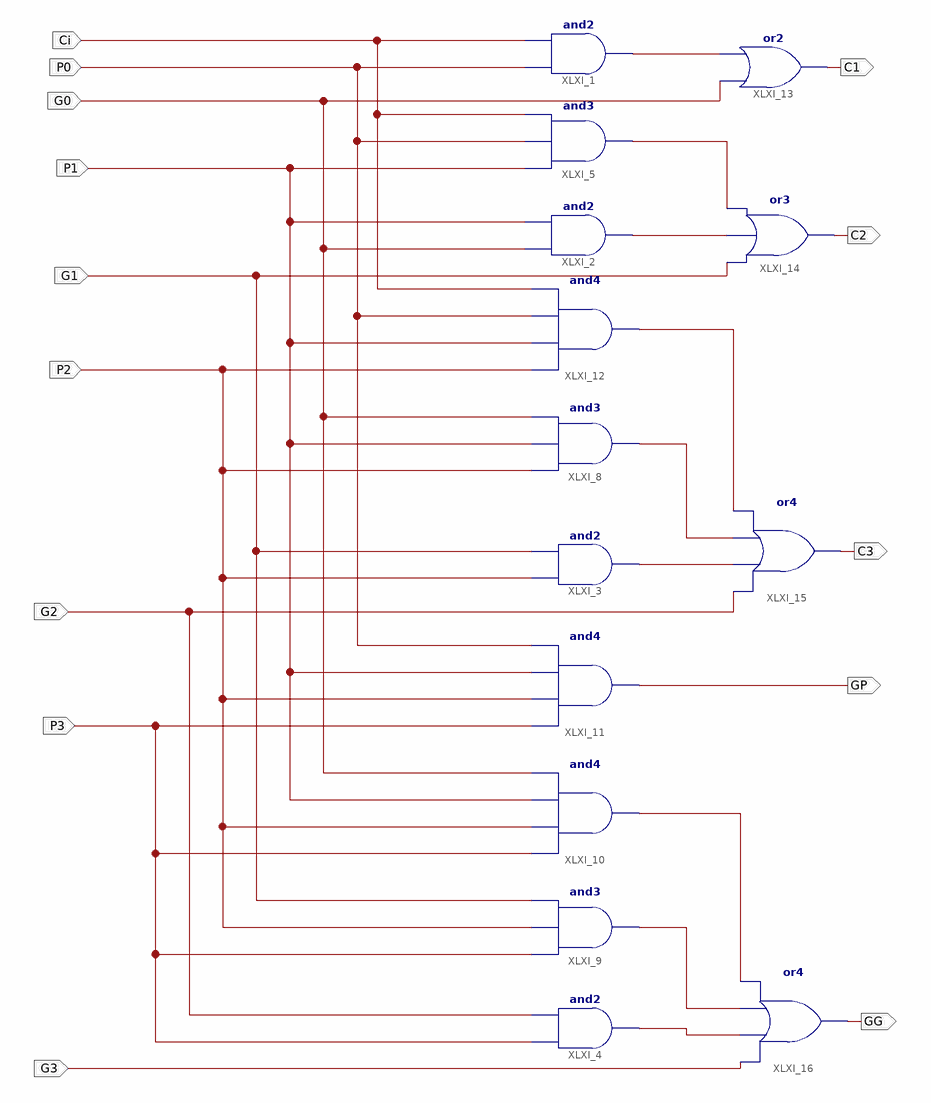
[diagram p0: schematic sheet 1]
// Xilinx ISE schematic CLA.sch (kintex7) as structural Verilog: 14 symbols, 14 ports
module CLA (
  input  Ci,
  input  P0,
  input  G0,
  input  P1,
  input  G1,
  input  P2,
  input  G3,
  input  G2,
  input  P3,
  output GP,
  output C1,
  output C2,
  output C3,
  output GG
);

  wire XLXN_17, XLXN_18, XLXN_19, XLXN_32, XLXN_33, XLXN_34, XLXN_35, XLXN_37, XLXN_38;

  and XLXI_1 (XLXN_18, P0, Ci);
  and XLXI_2 (XLXN_17, G0, P1);
  and XLXI_3 (XLXN_32, P2, G1);
  and XLXI_4 (XLXN_35, P3, G2);
  and XLXI_5 (XLXN_19, P1, P0, Ci);
  and XLXI_8 (XLXN_33, P2, P1, G0);
  and XLXI_9 (XLXN_38, P3, P2, G1);
  and XLXI_10 (XLXN_37, P3, P2, P1, G0);
  and XLXI_11 (GP, P3, P2, P1, P0);
  and XLXI_12 (XLXN_34, P2, P1, P0, Ci);
  or XLXI_13 (C1, G0, XLXN_18);
  or XLXI_14 (C2, G1, XLXN_17, XLXN_19);
  or XLXI_15 (C3, G2, XLXN_32, XLXN_33, XLXN_34);
  or XLXI_16 (GG, G3, XLXN_35, XLXN_38, XLXN_37);
endmodule
